# Altium schematic sheet PRO1.SchDoc
size A4
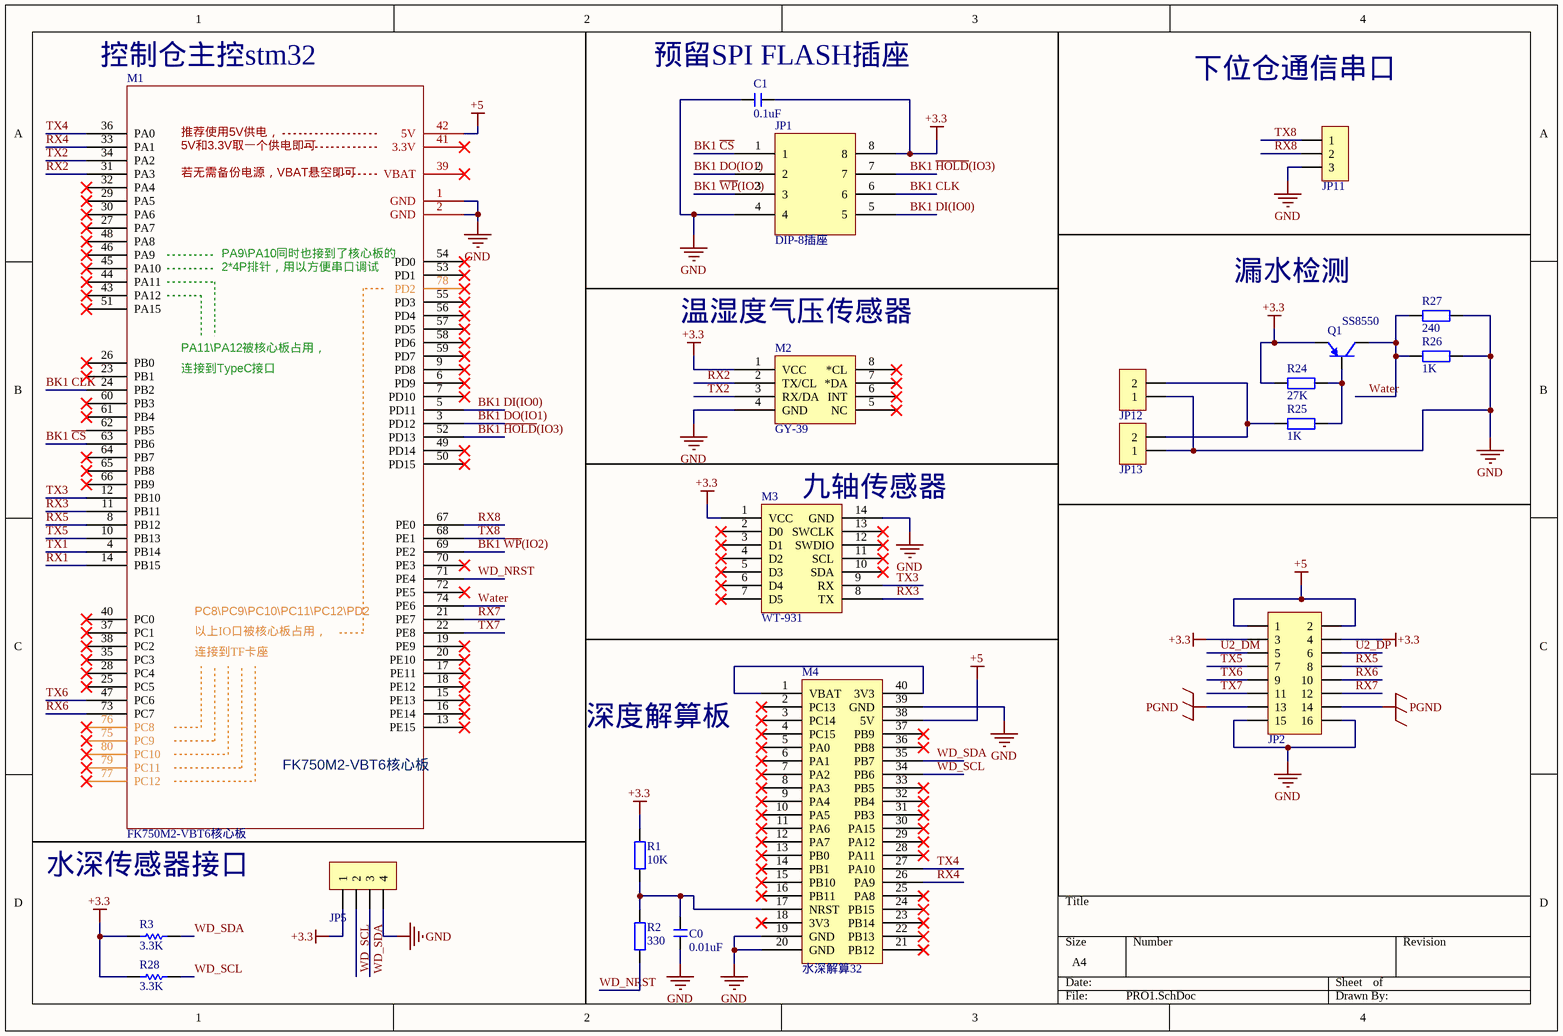
[diagram p0: PRO1.SchDoc]

## Parts
C0  0.01uF  [C 0603_M]
C1  0.1uF  [C 0603_M]
JP1  DIP-8插座  [DIP-8座]
JP2  Header 8X2  [IDC2.54-LI-2x8P]  (value not drawn)
JP5  HDR-1X4  [MX 1.25-LS-4P]  (value not drawn)
JP11  HDR-1X3  [PH2.0-LS-3P]  (value not drawn)
JP12  HDR-1X2  [GH1.25]  (value not drawn)
JP13  HDR-1X2  [GH1.25]  (value not drawn)
M1  FK750M2-VBT6核心板  [FK750M2-VBT6(精简版)]
M2  GY-39  [GY-39]
M3  WT-931  [WT-931]
M4  水深解算32  [Deep_32]
Q1  SS8550  [SOT23-3M]
R1  10K  [R 0603_M]
R2  330  [R 0805_L]
R3  3.3K  [0603R]
R24  27K  [R 0603_M]
R25  1K  [R 0603_M]
R26  1K  [R 0603_M]
R27  240  [R 0603_M]
R28  3.3K  [0603R]

## Nets
+3.3: C1.2 JP1.8 JP2.3 JP2.4 JP5.1 M2.1(VCC) M3.1(VCC) Q1.2(E) R1.2 R3.1 R24.1 R28.1
+5: JP2.1 JP2.2 M1.42(5V) M4.38(5V)
GND: C0.1 C1.1 JP1.4 JP2.15 JP2.16 JP5.4 JP11.3 JP12.1 JP13.1 M1.1(GND) M1.2(GND) M2.4(GND) M3.14(GND) M4.19(GND) M4.20(GND) M4.39(GND) R26.1 R27.2
PGND: JP2.13 JP2.14
BK1 ~{CS}: JP1.1 M1.63(PB6)
BK1 CLK: JP1.6 M1.24(PB2)
BK1 DI(IO0): JP1.5 M1.5(PD11)
BK1 DO(IO1): JP1.2 M1.3(PD12)
BK1 ~{HOLD}(IO3): JP1.7 M1.52(PD13)
BK1 ~{WP}(IO2): JP1.3 M1.69(PE2)
RX1: M1.14(PB15)
RX2: M1.31(PA3) M2.2(TX/CL)
RX3: M1.11(PB11) M3.8(TX)
RX4: M1.33(PA1) M4.26(PA9)
RX5: JP2.8 M1.8(PB12)
RX6: JP2.10 M1.73(PC7)
RX7: JP2.12 M1.21(PE7)
RX8: JP11.2 M1.67(PE0)
TX1: M1.4(PB14)
TX2: M1.34(PA2) M2.3(RX/DA)
TX3: M1.12(PB10) M3.9(RX)
TX4: M1.36(PA0) M4.27(PA10)
TX5: JP2.7 M1.10(PB13)
TX6: JP2.9 M1.47(PC6)
TX7: JP2.11 M1.22(PE8)
TX8: JP11.1 M1.68(PE1)
U2_DM: JP2.5
U2_DP: JP2.6
Water: M1.74(PE6) Q1.3(C) R26.2 R27.1
WD_NRST: M1.71(PE4) R2.1
WD_SCL: JP5.2 M4.34(PB6) R28.2
WD_SDA: JP5.3 M4.35(PB7) R3.2
NetC0_2: C0.2 M4.17(NRST) R1.1 R2.2
NetJP12_2: JP12.2 JP13.2 R25.2
NetM4_1: M4.1(VBAT) M4.40(3V3)
NetQ1_1: Q1.1(B) R24.2 R25.1

Not connected (* = marked no-connect by the designer): M1 6(PD9)* 7(PD10)* 9(PD8)* 13(PE15)* 15(PE13)* 16(PE14)* 17(PE11)* 18(PE12)* 19(PE9)* 20(PE10)* 23(PB1)* 25(PC5)* 26(PB0)* 27(PA7)* 28(PC4)* 29(PA5)* 30(PA6)* 32(PA4)* 35(PC3)* 37(PC1)* 38(PC2)* 39(VBAT)* 40(PC0)* 41(3.3V)* 43(PA12)* 44(PA11)* 45(PA10)* 46(PA9)* 48(PA8)* 49(PD14)* 50(PD15)* 51(PA15)* 53(PD1)* 54(PD0)* 55(PD3)* 56(PD4)* 57(PD5)* 58(PD6)* 59(PD7)* 60(PB3)* 61(PB4)* 62(PB5) 64(PB7)* 65(PB8)* 66(PB9)* 70(PE3)* 72(PE5)* 75(PC9)* 76(PC8)* 77(PC12)* 78(PD2)* 79(PC11)* 80(PC10)*; M2 5(NC)* 6(INT)* 7(*DA)* 8(*CL)*; M3 2(D0)* 3(D1)* 4(D2)* 5(D3)* 6(D4)* 7(D5)* 10(SDA)* 11(SCL)* 12(SWDIO)* 13(SWCLK)*; M4 2(PC13)* 3(PC14)* 4(PC15)* 5(PA0)* 6(PA1)* 7(PA2)* 8(PA3)* 9(PA4)* 10(PA5)* 11(PA6)* 12(PA7)* 13(PB0)* 14(PB1)* 15(PB10)* 16(PB11)* 18(3V3)* 21(PB12)* 22(PB13)* 23(PB14)* 24(PB15)* 25(PA8)* 28(PA11)* 29(PA12)* 30(PA15)* 31(PB3)* 32(PB4)* 33(PB5)* 36(PB8)* 37(PB9)*

## Notes on the sheet
- 控制仓主控stm32
- (near C1) 预留SPI FLASH插座
- 下位仓通信串口
- 漏水检测
- (near M2) 温湿度气压传感器
- (near M3) 九轴传感器
- 深度解算板
- 水深传感器接口
- (in symbol FK750M2-VBT6) 推荐使用5V供电，; 5V和3.3V取一个供电即可; 若无需备份电源，VBAT悬空即可; PA9\PA10同时也接到了核心板的; 2*4P排针，用以方便串口调试; PA11\PA12被核心板占用，; 连接到TypeC接口; PC8\PC9\PC10\PC11\PC12\PD2; 以上IO口被核心板占用，; 连接到TF卡座

## Library data of the parts
C0 C1 = C: 无极性贴片电容; 版权归属: 源创客; BOM名称: 无极性贴片电容; 学习资源: www.ooocke.com
JP2 = Header 8X2: 8*2P接插件; 版权归属: 源创客; BOM名称: 8*2P接插件; 学习资源: www.ooocke.com
JP5 = Header 4: 4P接插件; 版权归属: 源创客; BOM名称: 4P接插件; 学习资源: www.ooocke.com
JP11 = Header 3: 3P接插件; 版权归属: 源创客; BOM名称: 3P接插件; 学习资源: www.ooocke.com
JP12 JP13 = Header 2: 2P接插件; 版权归属: 源创客; BOM名称: 2P接插件; 学习资源: www.ooocke.com
M1 = FK750M2-VBT6
M2 = GY-39: 气压温湿度光强传感器
M3 = WT-931: WT-931姿态角度传感器
M4 = Deep_32: 水深传感器解算用的stm32模块
Q1 = 8550-SMD: 高频放大-PNP型; 版权归属: 源创客; 属性: 40V 1.5A 1W 100MHZ; BOM名称: 高频放大-PNP型; 学习资源: www.ooocke.com
R1 R2 R24-R27 = R: 贴片电阻; 版权归属: 源创客; BOM名称: 贴片电阻; 学习资源: www.ooocke.com
R3 R28 = RES